# EasyEDA Pro project ws2812_clock_PCB.epro, schematic Schematic1
Create Date: 2024-05-08; Page Name: P1; Project Name: ws2812_clock; Schematic Name: Schematic1; Update Date: 2024-05-08; Company: 嘉立创EDA; Page Size: A4; Version: V1.0
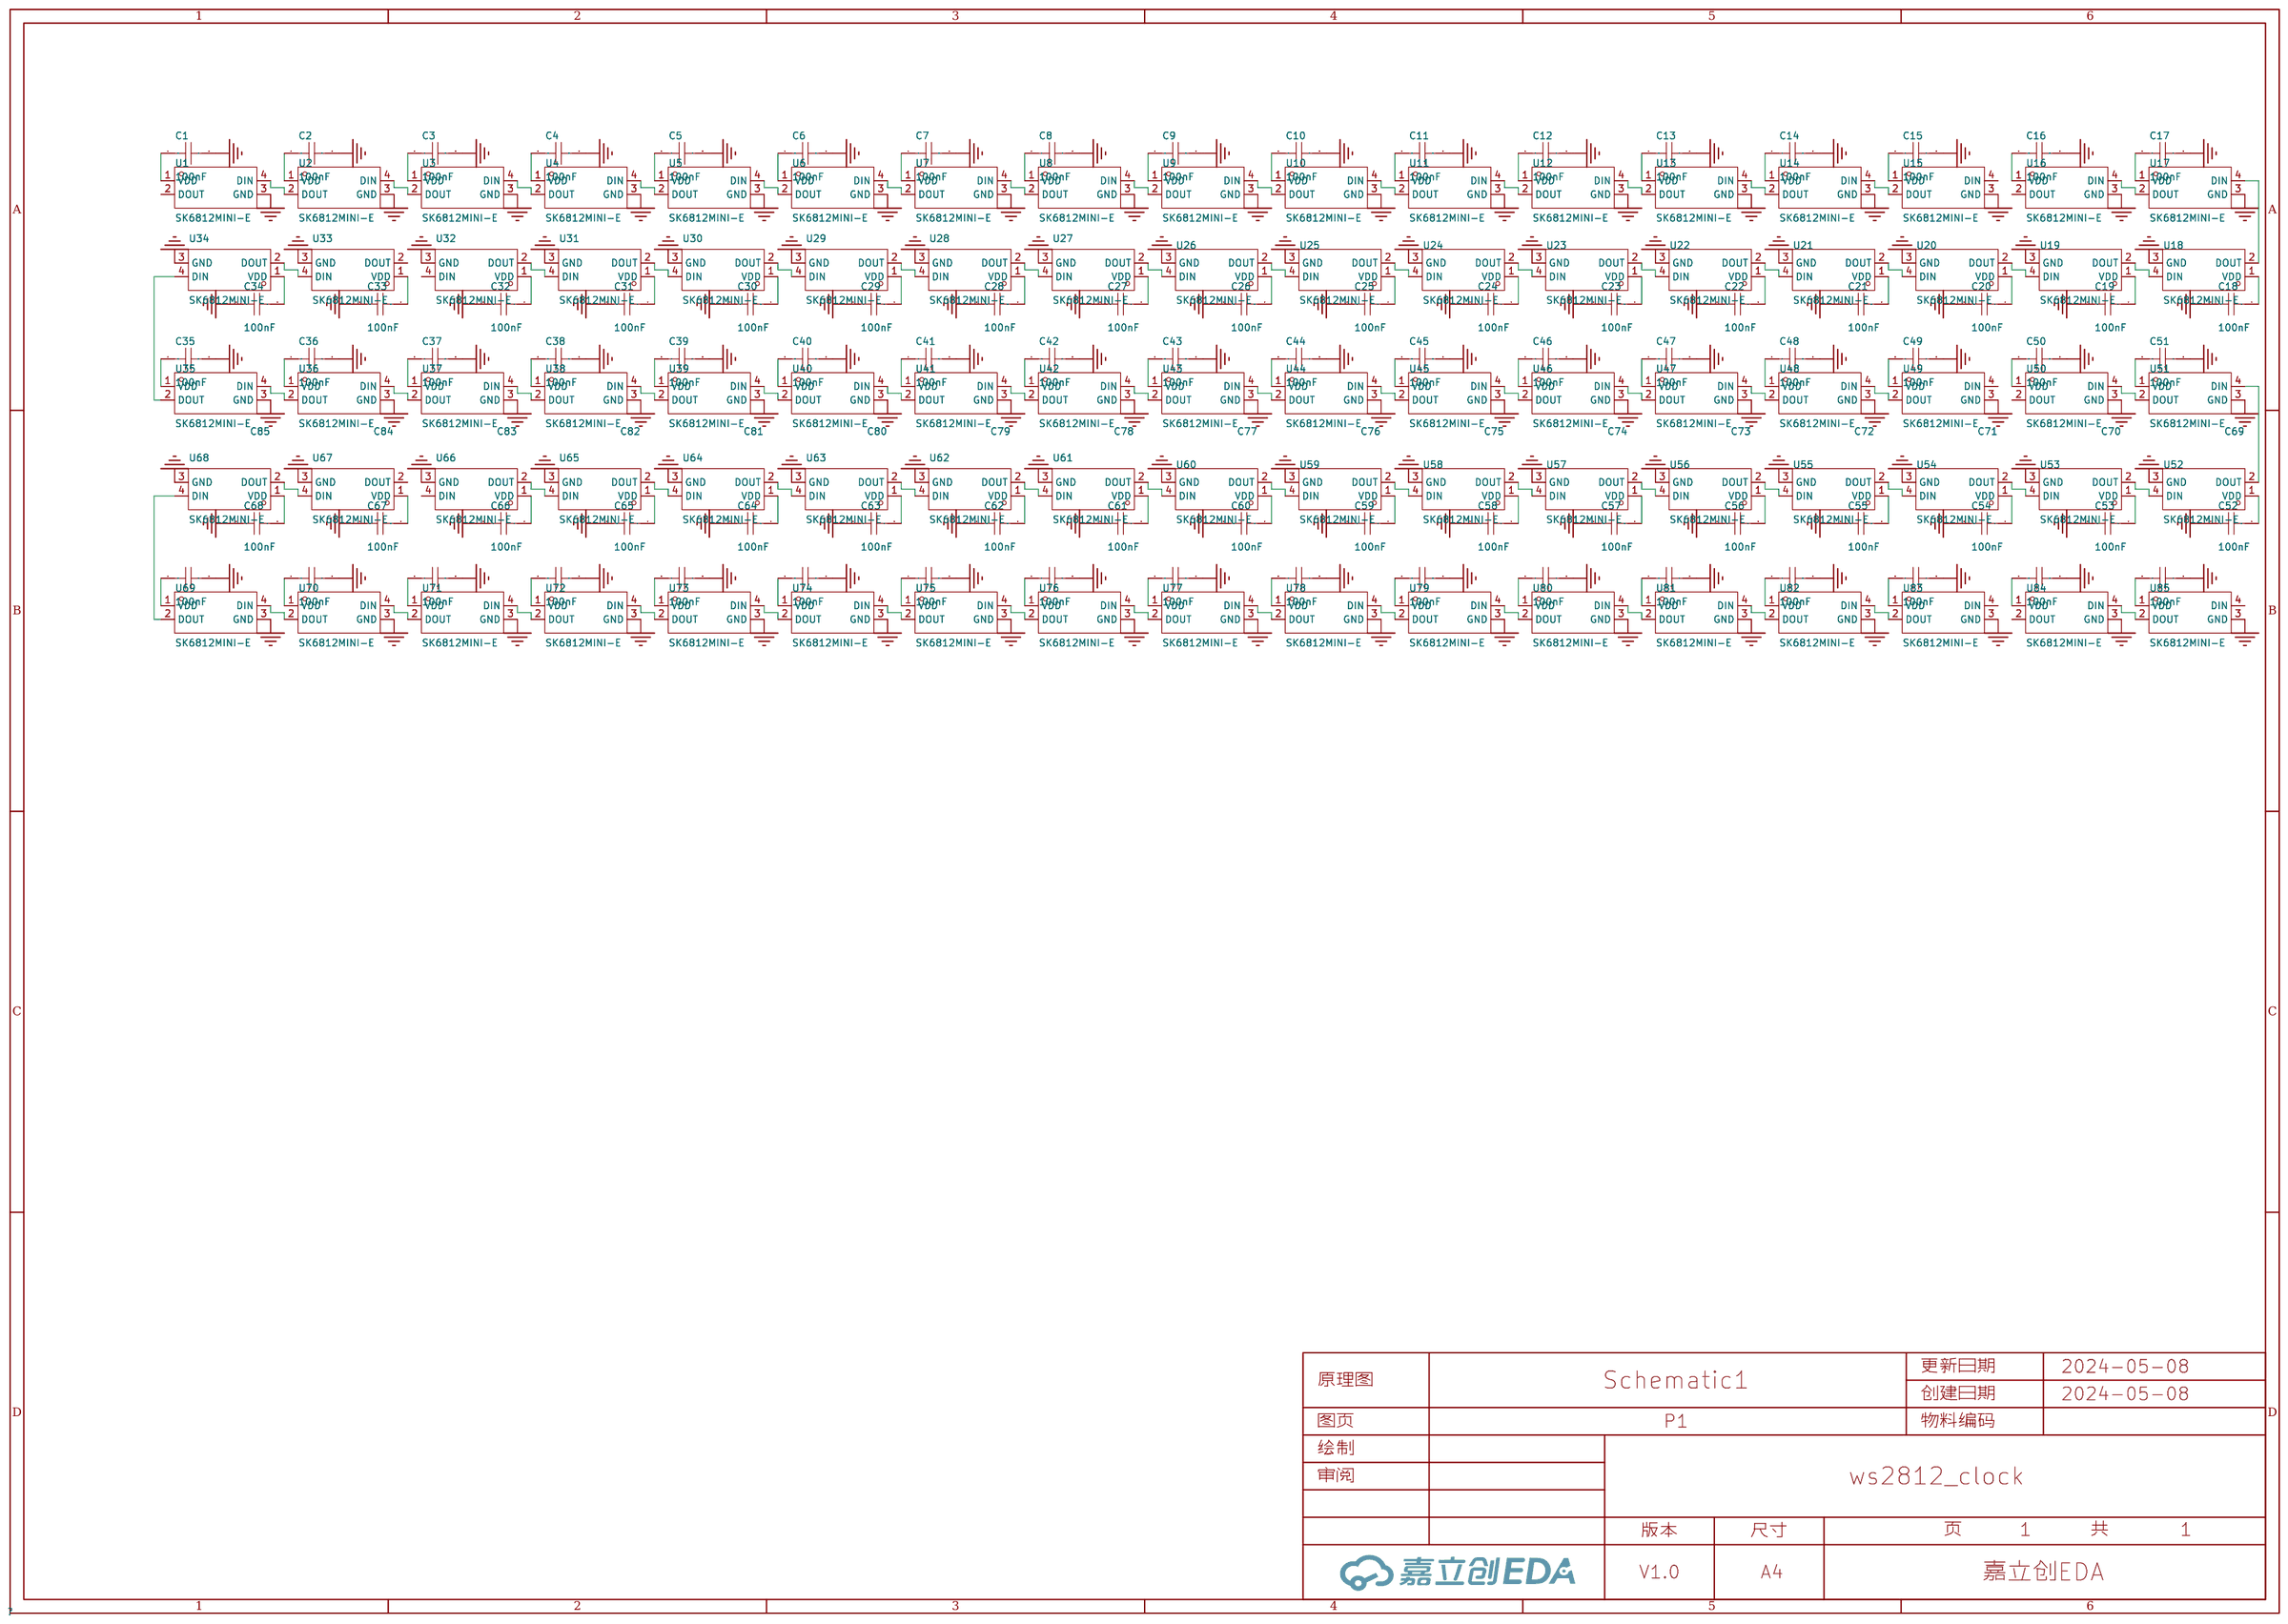
[diagram p0: schematic sheet]

## Parts
C1  100nF  [C0603]
C2  100nF  [C0603]
C3  100nF  [C0603]
C4  100nF  [C0603]
C5  100nF  [C0603]
C6  100nF  [C0603]
C7  100nF  [C0603]
C8  100nF  [C0603]
C9  100nF  [C0603]
C10  100nF  [C0603]
C11  100nF  [C0603]
C12  100nF  [C0603]
C13  100nF  [C0603]
C14  100nF  [C0603]
C15  100nF  [C0603]
C16  100nF  [C0603]
C17  100nF  [C0603]
C18  100nF  [C0603]
C19  100nF  [C0603]
C20  100nF  [C0603]
C21  100nF  [C0603]
C22  100nF  [C0603]
C23  100nF  [C0603]
C24  100nF  [C0603]
C25  100nF  [C0603]
C26  100nF  [C0603]
C27  100nF  [C0603]
C28  100nF  [C0603]
C29  100nF  [C0603]
C30  100nF  [C0603]
C31  100nF  [C0603]
C32  100nF  [C0603]
C33  100nF  [C0603]
C34  100nF  [C0603]
C35  100nF  [C0603]
C36  100nF  [C0603]
C37  100nF  [C0603]
C38  100nF  [C0603]
C39  100nF  [C0603]
C40  100nF  [C0603]
C41  100nF  [C0603]
C42  100nF  [C0603]
C43  100nF  [C0603]
C44  100nF  [C0603]
C45  100nF  [C0603]
C46  100nF  [C0603]
C47  100nF  [C0603]
C48  100nF  [C0603]
C49  100nF  [C0603]
C50  100nF  [C0603]
C51  100nF  [C0603]
C52  100nF  [C0603]
C53  100nF  [C0603]
C54  100nF  [C0603]
C55  100nF  [C0603]
C56  100nF  [C0603]
C57  100nF  [C0603]
C58  100nF  [C0603]
C59  100nF  [C0603]
C60  100nF  [C0603]
C61  100nF  [C0603]
C62  100nF  [C0603]
C63  100nF  [C0603]
C64  100nF  [C0603]
C65  100nF  [C0603]
C66  100nF  [C0603]
C67  100nF  [C0603]
C68  100nF  [C0603]
C69  100nF  [C0603]
C70  100nF  [C0603]
C71  100nF  [C0603]
C72  100nF  [C0603]
C73  100nF  [C0603]
C74  100nF  [C0603]
C75  100nF  [C0603]
C76  100nF  [C0603]
C77  100nF  [C0603]
C78  100nF  [C0603]
C79  100nF  [C0603]
C80  100nF  [C0603]
C81  100nF  [C0603]
C82  100nF  [C0603]
C83  100nF  [C0603]
C84  100nF  [C0603]
C85  100nF  [C0603]
U1  SK6812MINI-E  [LED-SMD_L3.2-W2.8-TR]
U2  SK6812MINI-E  [LED-SMD_L3.2-W2.8-TR]
U3  SK6812MINI-E  [LED-SMD_L3.2-W2.8-TR]
U4  SK6812MINI-E  [LED-SMD_L3.2-W2.8-TR]
U5  SK6812MINI-E  [LED-SMD_L3.2-W2.8-TR]
U6  SK6812MINI-E  [LED-SMD_L3.2-W2.8-TR]
U7  SK6812MINI-E  [LED-SMD_L3.2-W2.8-TR]
U8  SK6812MINI-E  [LED-SMD_L3.2-W2.8-TR]
U9  SK6812MINI-E  [LED-SMD_L3.2-W2.8-TR]
U10  SK6812MINI-E  [LED-SMD_L3.2-W2.8-TR]
U11  SK6812MINI-E  [LED-SMD_L3.2-W2.8-TR]
U12  SK6812MINI-E  [LED-SMD_L3.2-W2.8-TR]
U13  SK6812MINI-E  [LED-SMD_L3.2-W2.8-TR]
U14  SK6812MINI-E  [LED-SMD_L3.2-W2.8-TR]
U15  SK6812MINI-E  [LED-SMD_L3.2-W2.8-TR]
U16  SK6812MINI-E  [LED-SMD_L3.2-W2.8-TR]
U17  SK6812MINI-E  [LED-SMD_L3.2-W2.8-TR]
U18  SK6812MINI-E  [LED-SMD_L3.2-W2.8-TR]
U19  SK6812MINI-E  [LED-SMD_L3.2-W2.8-TR]
U20  SK6812MINI-E  [LED-SMD_L3.2-W2.8-TR]
U21  SK6812MINI-E  [LED-SMD_L3.2-W2.8-TR]
U22  SK6812MINI-E  [LED-SMD_L3.2-W2.8-TR]
U23  SK6812MINI-E  [LED-SMD_L3.2-W2.8-TR]
U24  SK6812MINI-E  [LED-SMD_L3.2-W2.8-TR]
U25  SK6812MINI-E  [LED-SMD_L3.2-W2.8-TR]
U26  SK6812MINI-E  [LED-SMD_L3.2-W2.8-TR]
U27  SK6812MINI-E  [LED-SMD_L3.2-W2.8-TR]
U28  SK6812MINI-E  [LED-SMD_L3.2-W2.8-TR]
U29  SK6812MINI-E  [LED-SMD_L3.2-W2.8-TR]
U30  SK6812MINI-E  [LED-SMD_L3.2-W2.8-TR]
U31  SK6812MINI-E  [LED-SMD_L3.2-W2.8-TR]
U32  SK6812MINI-E  [LED-SMD_L3.2-W2.8-TR]
U33  SK6812MINI-E  [LED-SMD_L3.2-W2.8-TR]
U34  SK6812MINI-E  [LED-SMD_L3.2-W2.8-TR]
U35  SK6812MINI-E  [LED-SMD_L3.2-W2.8-TR]
U36  SK6812MINI-E  [LED-SMD_L3.2-W2.8-TR]
U37  SK6812MINI-E  [LED-SMD_L3.2-W2.8-TR]
U38  SK6812MINI-E  [LED-SMD_L3.2-W2.8-TR]
U39  SK6812MINI-E  [LED-SMD_L3.2-W2.8-TR]
U40  SK6812MINI-E  [LED-SMD_L3.2-W2.8-TR]
U41  SK6812MINI-E  [LED-SMD_L3.2-W2.8-TR]
U42  SK6812MINI-E  [LED-SMD_L3.2-W2.8-TR]
U43  SK6812MINI-E  [LED-SMD_L3.2-W2.8-TR]
U44  SK6812MINI-E  [LED-SMD_L3.2-W2.8-TR]
U45  SK6812MINI-E  [LED-SMD_L3.2-W2.8-TR]
U46  SK6812MINI-E  [LED-SMD_L3.2-W2.8-TR]
U47  SK6812MINI-E  [LED-SMD_L3.2-W2.8-TR]
U48  SK6812MINI-E  [LED-SMD_L3.2-W2.8-TR]
U49  SK6812MINI-E  [LED-SMD_L3.2-W2.8-TR]
U50  SK6812MINI-E  [LED-SMD_L3.2-W2.8-TR]
U51  SK6812MINI-E  [LED-SMD_L3.2-W2.8-TR]
U52  SK6812MINI-E  [LED-SMD_L3.2-W2.8-TR]
U53  SK6812MINI-E  [LED-SMD_L3.2-W2.8-TR]
U54  SK6812MINI-E  [LED-SMD_L3.2-W2.8-TR]
U55  SK6812MINI-E  [LED-SMD_L3.2-W2.8-TR]
U56  SK6812MINI-E  [LED-SMD_L3.2-W2.8-TR]
U57  SK6812MINI-E  [LED-SMD_L3.2-W2.8-TR]
U58  SK6812MINI-E  [LED-SMD_L3.2-W2.8-TR]
U59  SK6812MINI-E  [LED-SMD_L3.2-W2.8-TR]
U60  SK6812MINI-E  [LED-SMD_L3.2-W2.8-TR]
U61  SK6812MINI-E  [LED-SMD_L3.2-W2.8-TR]
U62  SK6812MINI-E  [LED-SMD_L3.2-W2.8-TR]
U63  SK6812MINI-E  [LED-SMD_L3.2-W2.8-TR]
U64  SK6812MINI-E  [LED-SMD_L3.2-W2.8-TR]
U65  SK6812MINI-E  [LED-SMD_L3.2-W2.8-TR]
U66  SK6812MINI-E  [LED-SMD_L3.2-W2.8-TR]
U67  SK6812MINI-E  [LED-SMD_L3.2-W2.8-TR]
U68  SK6812MINI-E  [LED-SMD_L3.2-W2.8-TR]
U69  SK6812MINI-E  [LED-SMD_L3.2-W2.8-TR]
U70  SK6812MINI-E  [LED-SMD_L3.2-W2.8-TR]
U71  SK6812MINI-E  [LED-SMD_L3.2-W2.8-TR]
U72  SK6812MINI-E  [LED-SMD_L3.2-W2.8-TR]
U73  SK6812MINI-E  [LED-SMD_L3.2-W2.8-TR]
U74  SK6812MINI-E  [LED-SMD_L3.2-W2.8-TR]
U75  SK6812MINI-E  [LED-SMD_L3.2-W2.8-TR]
U76  SK6812MINI-E  [LED-SMD_L3.2-W2.8-TR]
U77  SK6812MINI-E  [LED-SMD_L3.2-W2.8-TR]
U78  SK6812MINI-E  [LED-SMD_L3.2-W2.8-TR]
U79  SK6812MINI-E  [LED-SMD_L3.2-W2.8-TR]
U80  SK6812MINI-E  [LED-SMD_L3.2-W2.8-TR]
U81  SK6812MINI-E  [LED-SMD_L3.2-W2.8-TR]
U82  SK6812MINI-E  [LED-SMD_L3.2-W2.8-TR]
U83  SK6812MINI-E  [LED-SMD_L3.2-W2.8-TR]
U84  SK6812MINI-E  [LED-SMD_L3.2-W2.8-TR]
U85  SK6812MINI-E  [LED-SMD_L3.2-W2.8-TR]

## Library data of the parts
C1-C85 = CAP_0603: Supplier Footprint: 0603
U1-U85 = SK6812MINI-E_C5149201: Supplier Part: C5149201; Manufacturer: 欧思科光电; Supplier Footprint: SMD; JLCPCB Part Class: 扩展库; Supplier: LCSC

## Nets
GND: C1.2 C2.2 C3.2 C4.2 C5.2 C6.2 C7.2 C8.2 C9.2 C10.2 C11.2 C12.2 C13.2 C14.2 C15.2 C16.2 C17.2 C18.2 C19.2 C20.2 C21.2 C22.2 C23.2 C24.2 C25.2 C26.2 C27.2 C28.2 C29.2 C30.2 C31.2 C32.2 C33.2 C34.2 C35.2 C36.2 C37.2 C38.2 C39.2 C40.2 C41.2 C42.2 C43.2 C44.2 C45.2 C46.2 C47.2 C48.2 C49.2 C50.2 C51.2 C52.2 C53.2 C54.2 C55.2 C56.2 C57.2 C58.2 C59.2 C60.2 C61.2 C62.2 C63.2 C64.2 C65.2 C66.2 C67.2 C68.2 C69.2 C70.2 C71.2 C72.2 C73.2 C74.2 C75.2 C76.2 C77.2 C78.2 C79.2 C80.2 C81.2 C82.2 C83.2 C84.2 C85.2 U1.3(GND) U2.3(GND) U3.3(GND) U4.3(GND) U5.3(GND) U6.3(GND) U7.3(GND) U8.3(GND) U9.3(GND) U10.3(GND) U11.3(GND) U12.3(GND) U13.3(GND) U14.3(GND) U15.3(GND) U16.3(GND) U17.3(GND) U18.3(GND) U19.3(GND) U20.3(GND) U21.3(GND) U22.3(GND) U23.3(GND) U24.3(GND) U25.3(GND) U26.3(GND) U27.3(GND) U28.3(GND) U29.3(GND) U30.3(GND) U31.3(GND) U32.3(GND) U33.3(GND) U34.3(GND) U35.3(GND) U36.3(GND) U37.3(GND) U38.3(GND) U39.3(GND) U40.3(GND) U41.3(GND) U42.3(GND) U43.3(GND) U44.3(GND) U45.3(GND) U46.3(GND) U47.3(GND) U48.3(GND) U49.3(GND) U50.3(GND) U51.3(GND) U52.3(GND) U53.3(GND) U54.3(GND) U55.3(GND) U56.3(GND) U57.3(GND) U58.3(GND) U59.3(GND) U60.3(GND) U61.3(GND) U62.3(GND) U63.3(GND) U64.3(GND) U65.3(GND) U66.3(GND) U67.3(GND) U68.3(GND) U69.3(GND) U70.3(GND) U71.3(GND) U72.3(GND) U73.3(GND) U74.3(GND) U75.3(GND) U76.3(GND) U77.3(GND) U78.3(GND) U79.3(GND) U80.3(GND) U81.3(GND) U82.3(GND) U83.3(GND) U84.3(GND) U85.3(GND)
$1N8905: C1.1 U1.1(VDD)
$1N9044: C2.1 U2.1(VDD)
$1N9136: C3.1 U3.1(VDD)
$1N9146: U1.4(DIN) U2.2(DOUT)
$1N9151: U2.4(DIN) U3.2(DOUT)
$1N9406: C4.1 U4.1(VDD)
$1N9412: C5.1 U5.1(VDD)
$1N9418: C6.1 U6.1(VDD)
$1N9424: U4.4(DIN) U5.2(DOUT)
$1N9428: U5.4(DIN) U6.2(DOUT)
$1N9690: C7.1 U7.1(VDD)
$1N9696: C8.1 U8.1(VDD)
$1N9702: C9.1 U9.1(VDD)
$1N9708: U7.4(DIN) U8.2(DOUT)
$1N9712: U8.4(DIN) U9.2(DOUT)
$1N9974: C10.1 U10.1(VDD)
$1N9980: C11.1 U11.1(VDD)
$1N9986: C12.1 U12.1(VDD)
$1N9992: U10.4(DIN) U11.2(DOUT)
$1N9996: U11.4(DIN) U12.2(DOUT)
$1N10258: C13.1 U13.1(VDD)
$1N10264: C14.1 U14.1(VDD)
$1N10270: C15.1 U15.1(VDD)
$1N10276: U13.4(DIN) U14.2(DOUT)
$1N10280: U14.4(DIN) U15.2(DOUT)
$1N10542: C16.1 U16.1(VDD)
$1N10548: C17.1 U17.1(VDD)
$1N10560: U16.4(DIN) U17.2(DOUT)
$1N10599: U3.4(DIN) U4.2(DOUT)
$1N10604: U6.4(DIN) U7.2(DOUT)
$1N10609: U9.4(DIN) U10.2(DOUT)
$1N10614: U12.4(DIN) U13.2(DOUT)
$1N12809: C18.1 U18.1(VDD)
$1N12812: C19.1 U19.1(VDD)
$1N12815: C20.1 U20.1(VDD)
$1N12818: U18.4(DIN) U19.2(DOUT)
$1N12819: U19.4(DIN) U20.2(DOUT)
$1N12820: C21.1 U21.1(VDD)
$1N12823: C22.1 U22.1(VDD)
$1N12826: C23.1 U23.1(VDD)
$1N12829: U21.4(DIN) U22.2(DOUT)
$1N12830: U22.4(DIN) U23.2(DOUT)
$1N12831: C24.1 U24.1(VDD)
$1N12834: C25.1 U25.1(VDD)
$1N12837: C26.1 U26.1(VDD)
$1N12840: U24.4(DIN) U25.2(DOUT)
$1N12841: U25.4(DIN) U26.2(DOUT)
$1N12842: C27.1 U27.1(VDD)
$1N12845: C28.1 U28.1(VDD)
$1N12848: C29.1 U29.1(VDD)
$1N12851: U27.4(DIN) U28.2(DOUT)
$1N12852: U28.4(DIN) U29.2(DOUT)
$1N12853: C30.1 U30.1(VDD)
$1N12856: C31.1 U31.1(VDD)
$1N12859: C32.1 U32.1(VDD)
$1N12862: U30.4(DIN) U31.2(DOUT)
$1N12863: U31.4(DIN) U32.2(DOUT)
$1N12864: C33.1 U33.1(VDD)
$1N12867: C34.1 U34.1(VDD)
$1N12869: U33.4(DIN) U34.2(DOUT)
$1N12871: U20.4(DIN) U21.2(DOUT)
$1N12872: U23.4(DIN) U24.2(DOUT)
$1N12873: U26.4(DIN) U27.2(DOUT)
$1N12874: U29.4(DIN) U30.2(DOUT)
$1N14337: C35.1 U35.1(VDD)
$1N14340: C36.1 U36.1(VDD)
$1N14343: C37.1 U37.1(VDD)
$1N14346: U35.4(DIN) U36.2(DOUT)
$1N14347: U36.4(DIN) U37.2(DOUT)
$1N14348: C38.1 U38.1(VDD)
$1N14351: C39.1 U39.1(VDD)
$1N14354: C40.1 U40.1(VDD)
$1N14357: U38.4(DIN) U39.2(DOUT)
$1N14358: U39.4(DIN) U40.2(DOUT)
$1N14359: C41.1 U41.1(VDD)
$1N14362: C42.1 U42.1(VDD)
$1N14365: C43.1 U43.1(VDD)
$1N14368: U41.4(DIN) U42.2(DOUT)
$1N14369: U42.4(DIN) U43.2(DOUT)
$1N14370: C44.1 U44.1(VDD)
$1N14373: C45.1 U45.1(VDD)
$1N14376: C46.1 U46.1(VDD)
$1N14379: U44.4(DIN) U45.2(DOUT)
$1N14380: U45.4(DIN) U46.2(DOUT)
$1N14381: C47.1 U47.1(VDD)
$1N14384: C48.1 U48.1(VDD)
$1N14387: C49.1 U49.1(VDD)
$1N14390: U47.4(DIN) U48.2(DOUT)
$1N14391: U48.4(DIN) U49.2(DOUT)
$1N14392: C50.1 U50.1(VDD)
$1N14395: C51.1 U51.1(VDD)
$1N14397: U50.4(DIN) U51.2(DOUT)
$1N14399: U37.4(DIN) U38.2(DOUT)
$1N14400: U40.4(DIN) U41.2(DOUT)
$1N14401: U43.4(DIN) U44.2(DOUT)
$1N14402: U46.4(DIN) U47.2(DOUT)
$1N15865: C52.1 U52.1(VDD)
$1N15868: C53.1 U53.1(VDD)
$1N15871: C54.1 U54.1(VDD)
$1N15874: U52.4(DIN) U53.2(DOUT)
$1N15875: U53.4(DIN) U54.2(DOUT)
$1N15876: C55.1 U55.1(VDD)
$1N15879: C56.1 U56.1(VDD)
$1N15882: C57.1 U57.1(VDD)
$1N15885: U55.4(DIN) U56.2(DOUT)
$1N15886: U56.4(DIN) U57.2(DOUT)
$1N15887: C58.1 U58.1(VDD)
$1N15890: C59.1 U59.1(VDD)
$1N15893: C60.1 U60.1(VDD)
$1N15896: U58.4(DIN) U59.2(DOUT)
$1N15897: U59.4(DIN) U60.2(DOUT)
$1N15898: C61.1 U61.1(VDD)
$1N15901: C62.1 U62.1(VDD)
$1N15904: C63.1 U63.1(VDD)
$1N15907: U61.4(DIN) U62.2(DOUT)
$1N15908: U62.4(DIN) U63.2(DOUT)
$1N15909: C64.1 U64.1(VDD)
$1N15912: C65.1 U65.1(VDD)
$1N15915: C66.1 U66.1(VDD)
$1N15918: U64.4(DIN) U65.2(DOUT)
$1N15919: U65.4(DIN) U66.2(DOUT)
$1N15920: C67.1 U67.1(VDD)
$1N15923: C68.1 U68.1(VDD)
$1N15925: U67.4(DIN) U68.2(DOUT)
$1N15927: U54.4(DIN) U55.2(DOUT)
$1N15928: U57.4(DIN) U58.2(DOUT)
$1N15929: U60.4(DIN) U61.2(DOUT)
$1N15930: U63.4(DIN) U64.2(DOUT)
$1N17393: C69.1 U69.1(VDD)
$1N17396: C70.1 U70.1(VDD)
$1N17399: C71.1 U71.1(VDD)
$1N17402: U69.4(DIN) U70.2(DOUT)
$1N17403: U70.4(DIN) U71.2(DOUT)
$1N17404: C72.1 U72.1(VDD)
$1N17407: C73.1 U73.1(VDD)
$1N17410: C74.1 U74.1(VDD)
$1N17413: U72.4(DIN) U73.2(DOUT)
$1N17414: U73.4(DIN) U74.2(DOUT)
$1N17415: C75.1 U75.1(VDD)
$1N17418: C76.1 U76.1(VDD)
$1N17421: C77.1 U77.1(VDD)
$1N17424: U75.4(DIN) U76.2(DOUT)
$1N17425: U76.4(DIN) U77.2(DOUT)
$1N17426: C78.1 U78.1(VDD)
$1N17429: C79.1 U79.1(VDD)
$1N17432: C80.1 U80.1(VDD)
$1N17435: U78.4(DIN) U79.2(DOUT)
$1N17436: U79.4(DIN) U80.2(DOUT)
$1N17437: C81.1 U81.1(VDD)
$1N17440: C82.1 U82.1(VDD)
$1N17443: C83.1 U83.1(VDD)
$1N17446: U81.4(DIN) U82.2(DOUT)
$1N17447: U82.4(DIN) U83.2(DOUT)
$1N17448: C84.1 U84.1(VDD)
$1N17451: C85.1 U85.1(VDD)
$1N17453: U84.4(DIN) U85.2(DOUT)
$1N17455: U71.4(DIN) U72.2(DOUT)
$1N17456: U74.4(DIN) U75.2(DOUT)
$1N17457: U77.4(DIN) U78.2(DOUT)
$1N17458: U80.4(DIN) U81.2(DOUT)
$1N17495: U17.4(DIN) U18.2(DOUT)
$1N17503: U51.4(DIN) U52.2(DOUT)
$1N17507: U34.4(DIN) U35.2(DOUT)
$1N17519: U68.4(DIN) U69.2(DOUT)

Not connected (* = marked no-connect by the designer): U1 2(DOUT); U15 4(DIN); U16 2(DOUT); U32 4(DIN); U33 2(DOUT); U49 4(DIN); U50 2(DOUT); U66 4(DIN); U67 2(DOUT); U83 4(DIN); U84 2(DOUT); U85 4(DIN)
